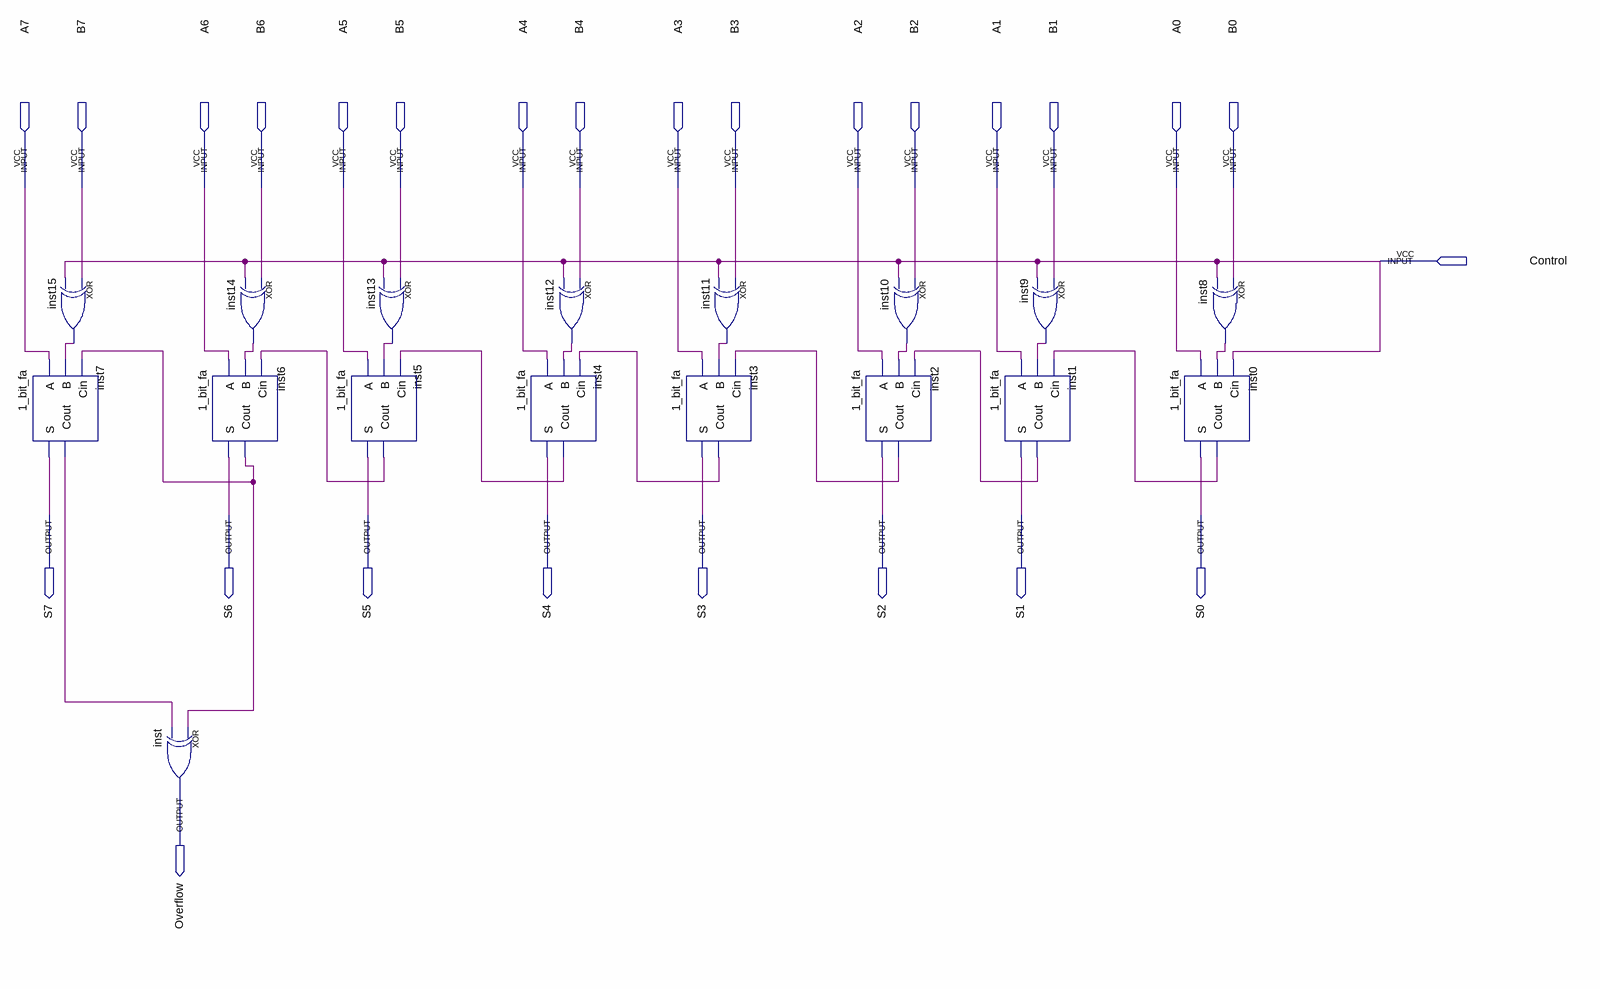
[diagram p0: schematic sheet]
// Quartus schematic 8_bit_add_sub.bdf as structural Verilog: 17 symbols, 26 pins
module \8_bit_add_sub  (
  input  A7,
  input  B7,
  input  A6,
  input  B6,
  input  A5,
  input  B5,
  input  A4,
  input  B4,
  input  A3,
  input  B3,
  input  A2,
  input  B2,
  input  A1,
  input  B1,
  input  A0,
  input  B0,
  input  Control,
  output S7,
  output S6,
  output S5,
  output S4,
  output S3,
  output S2,
  output S1,
  output S0,
  output Overflow
);

  wire inst0_cout, inst1_cout, inst2_cout, inst3_cout, inst4_cout, inst5_cout, inst6_cout, inst7_cout,
       inst8_out, inst9_out, inst10_out, inst11_out, inst12_out, inst13_out, inst14_out, inst15_out;

  \1_bit_fa  inst7 (.A(A7), .B(inst15_out), .Cin(inst6_cout), .S(S7), .Cout(inst7_cout));
  xor inst15 (inst15_out, B7, Control);
  xor inst (Overflow, inst6_cout, inst7_cout);
  xor inst14 (inst14_out, B6, Control);
  \1_bit_fa  inst6 (.A(A6), .B(inst14_out), .Cin(inst5_cout), .S(S6), .Cout(inst6_cout));
  xor inst13 (inst13_out, B5, Control);
  \1_bit_fa  inst5 (.A(A5), .B(inst13_out), .Cin(inst4_cout), .S(S5), .Cout(inst5_cout));
  xor inst12 (inst12_out, B4, Control);
  \1_bit_fa  inst4 (.A(A4), .B(inst12_out), .Cin(inst3_cout), .S(S4), .Cout(inst4_cout));
  \1_bit_fa  inst3 (.A(A3), .B(inst11_out), .Cin(inst2_cout), .S(S3), .Cout(inst3_cout));
  xor inst11 (inst11_out, B3, Control);
  xor inst10 (inst10_out, B2, Control);
  \1_bit_fa  inst2 (.A(A2), .B(inst10_out), .Cin(inst1_cout), .S(S2), .Cout(inst2_cout));
  xor inst9 (inst9_out, B1, Control);
  \1_bit_fa  inst1 (.A(A1), .B(inst9_out), .Cin(inst0_cout), .S(S1), .Cout(inst1_cout));
  xor inst8 (inst8_out, B0, Control);
  \1_bit_fa  inst0 (.A(A0), .B(inst8_out), .Cin(Control), .S(S0), .Cout(inst0_cout));
endmodule
